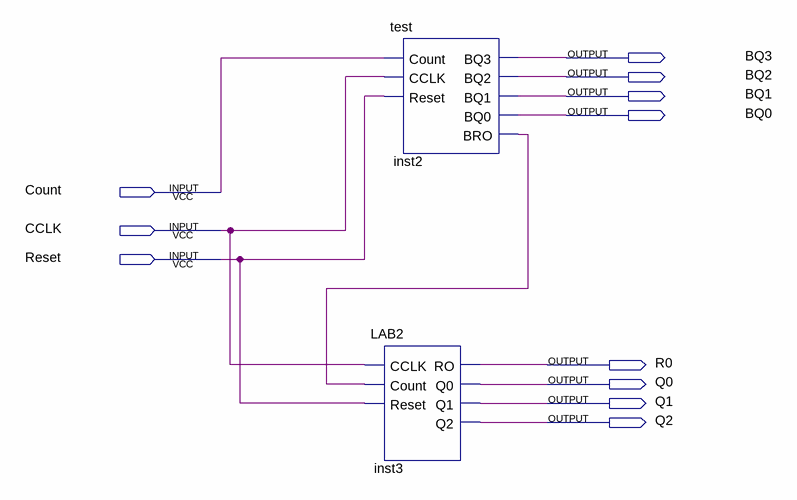
[diagram p0: schematic sheet]
// Quartus schematic Mod60.bdf as structural Verilog: 2 symbols, 11 pins
module Mod60 (
  input  Count,
  input  CCLK,
  input  Reset,
  output BQ3,
  output BQ2,
  output BQ1,
  output BQ0,
  output R0,
  output Q0,
  output Q1,
  output Q2
);

  wire inst2_bro;

  LAB2 inst3 (.CCLK(CCLK), .Count(inst2_bro), .Reset(Reset), .RO(R0), .Q0(Q0), .Q1(Q1), .Q2(Q2));
  test inst2 (.Count(Count), .CCLK(CCLK), .Reset(Reset), .BQ3(BQ3), .BQ2(BQ2), .BQ1(BQ1), .BQ0(BQ0), .BRO(inst2_bro));
endmodule
